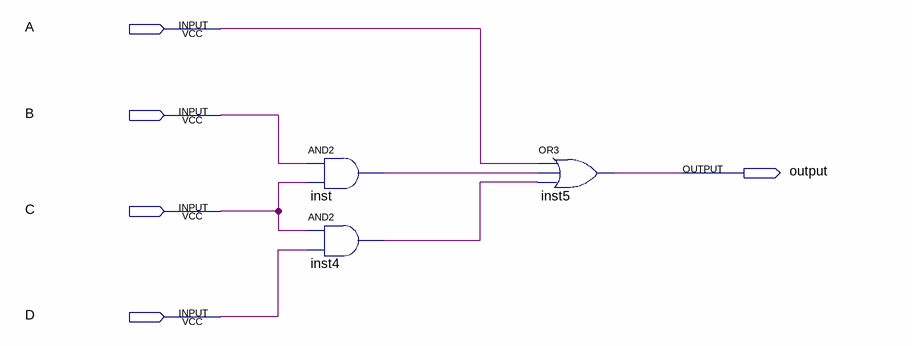
[diagram p0: schematic sheet]
// Quartus schematic IsOverflow.bdf as structural Verilog: 3 symbols, 5 pins
module IsOverflow (
  input  A,
  input  B,
  input  C,
  input  D,
  output \output 
);

  wire inst4_out, inst_out;

  and inst (inst_out, B, C);
  and inst4 (inst4_out, C, D);
  or inst5 (\output , A, inst_out, inst4_out);
endmodule
